# Altium schematic sheet Sheet2.SchDoc
size B
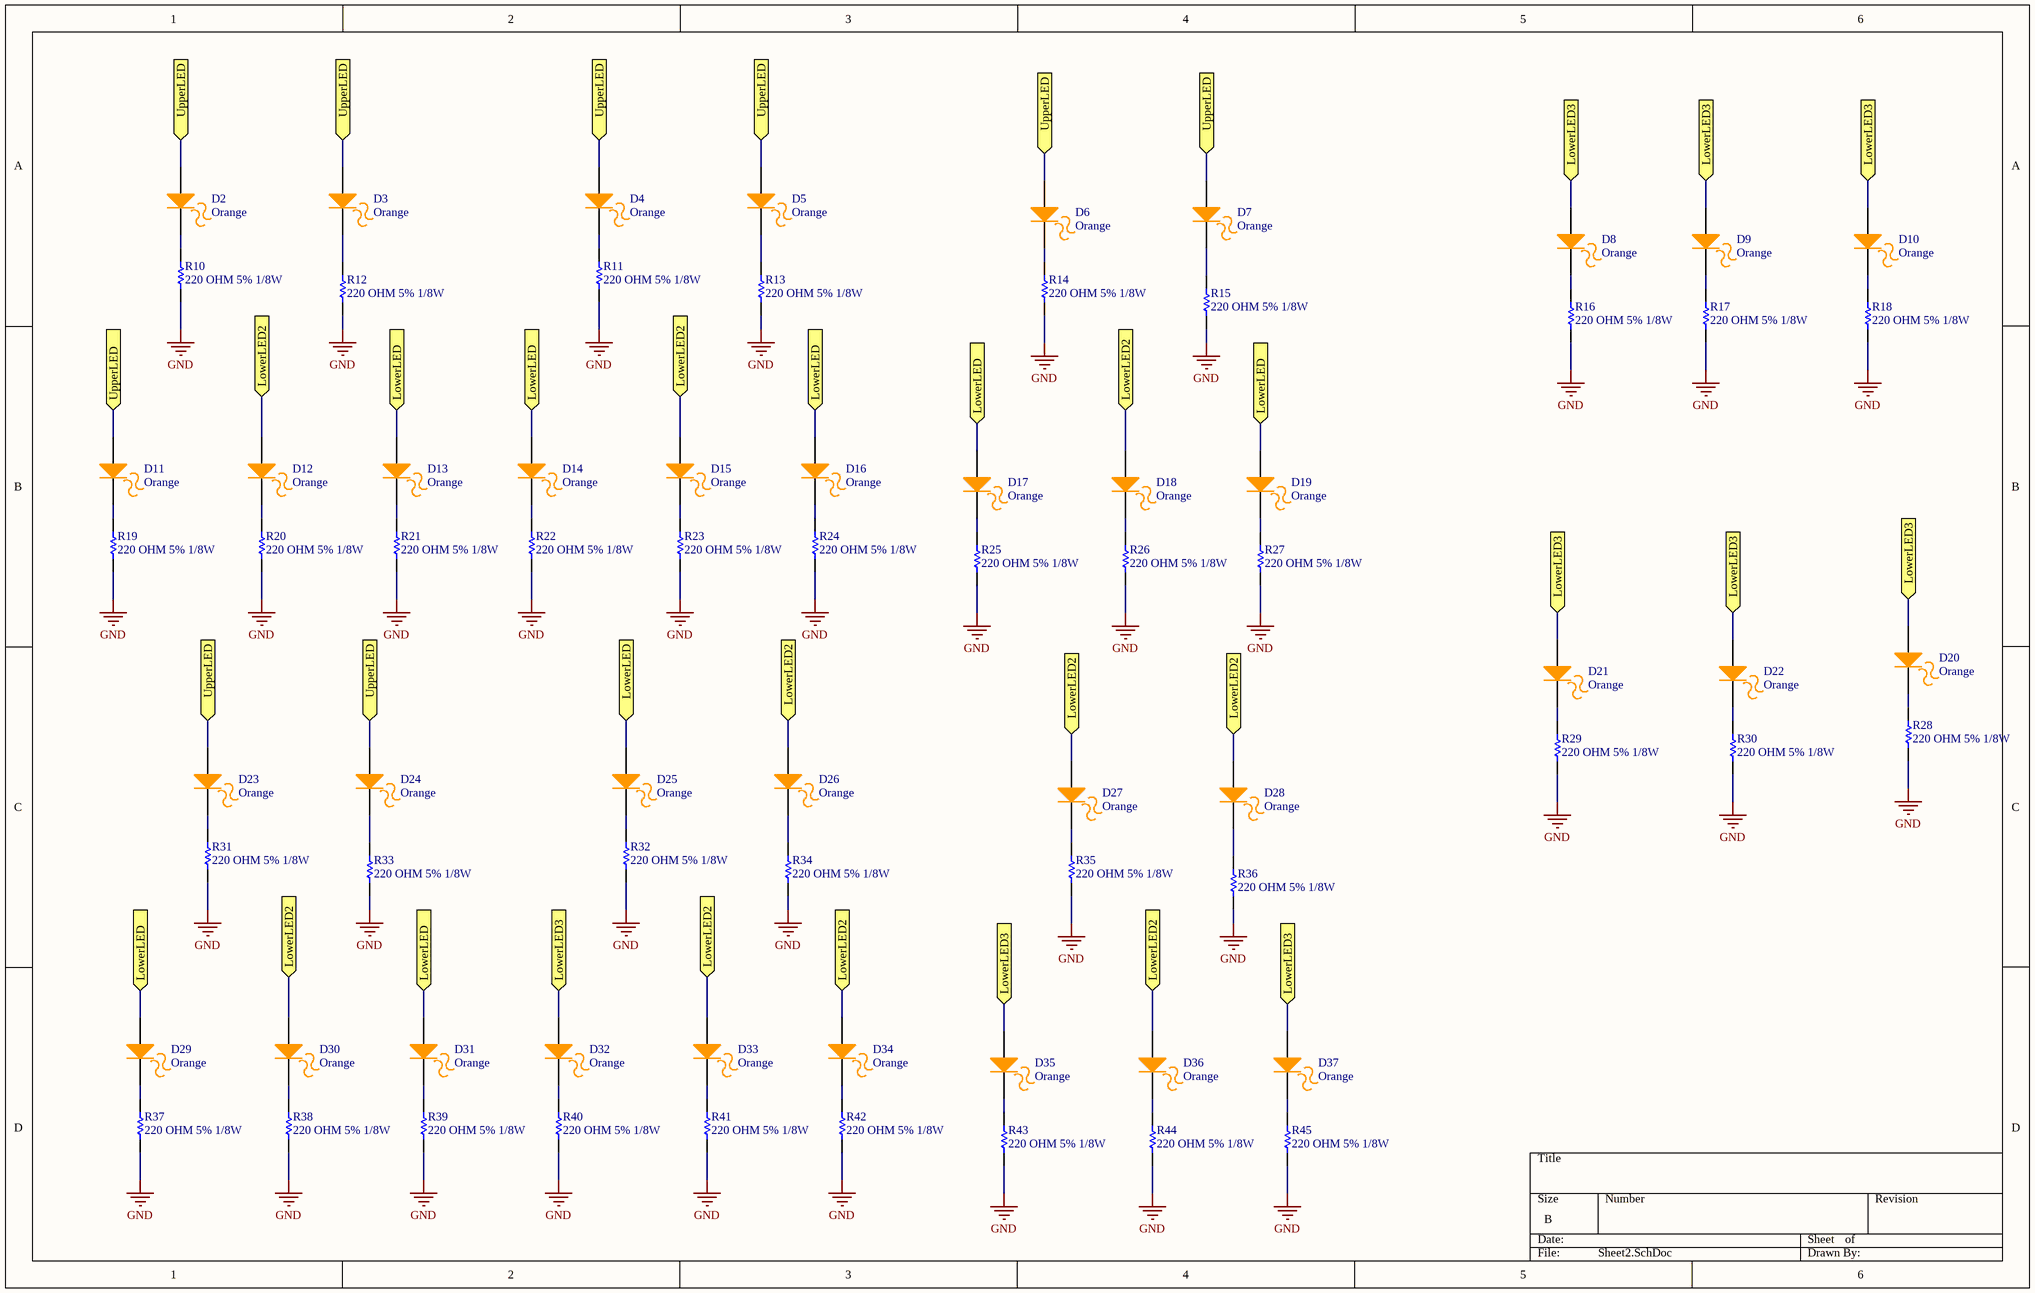
[diagram p0: Sheet2.SchDoc]

## Parts
D2  Orange  [0603 LED Green]
D3  Orange  [0603 LED Green]
D4  Orange  [0603 LED Green]
D5  Orange  [0603 LED Green]
D6  Orange  [0603 LED Green]
D7  Orange  [0603 LED Green]
D8  Orange  [0603 LED Green]
D9  Orange  [0603 LED Green]
D10  Orange  [0603 LED Green]
D11  Orange  [0603 LED Green]
D12  Orange  [0603 LED Green]
D13  Orange  [0603 LED Green]
D14  Orange  [0603 LED Green]
D15  Orange  [0603 LED Green]
D16  Orange  [0603 LED Green]
D17  Orange  [0603 LED Green]
D18  Orange  [0603 LED Green]
D19  Orange  [0603 LED Green]
D20  Orange  [0603 LED Green]
D21  Orange  [0603 LED Green]
D22  Orange  [0603 LED Green]
D23  Orange  [0603 LED Green]
D24  Orange  [0603 LED Green]
D25  Orange  [0603 LED Green]
D26  Orange  [0603 LED Green]
D27  Orange  [0603 LED Green]
D28  Orange  [0603 LED Green]
D29  Orange  [0603 LED Green]
D30  Orange  [0603 LED Green]
D31  Orange  [0603 LED Green]
D32  Orange  [0603 LED Green]
D33  Orange  [0603 LED Green]
D34  Orange  [0603 LED Green]
D35  Orange  [0603 LED Green]
D36  Orange  [0603 LED Green]
D37  Orange  [0603 LED Green]
R10  220 OHM 5% 1/8W  [SMD-0805-RES]
R11  220 OHM 5% 1/8W  [SMD-0805-RES]
R12  220 OHM 5% 1/8W  [SMD-0805-RES]
R13  220 OHM 5% 1/8W  [SMD-0805-RES]
R14  220 OHM 5% 1/8W  [SMD-0805-RES]
R15  220 OHM 5% 1/8W  [SMD-0805-RES]
R16  220 OHM 5% 1/8W  [SMD-0805-RES]
R17  220 OHM 5% 1/8W  [SMD-0805-RES]
R18  220 OHM 5% 1/8W  [SMD-0805-RES]
R19  220 OHM 5% 1/8W  [SMD-0805-RES]
R20  220 OHM 5% 1/8W  [SMD-0805-RES]
R21  220 OHM 5% 1/8W  [SMD-0805-RES]
R22  220 OHM 5% 1/8W  [SMD-0805-RES]
R23  220 OHM 5% 1/8W  [SMD-0805-RES]
R24  220 OHM 5% 1/8W  [SMD-0805-RES]
R25  220 OHM 5% 1/8W  [SMD-0805-RES]
R26  220 OHM 5% 1/8W  [SMD-0805-RES]
R27  220 OHM 5% 1/8W  [SMD-0805-RES]
R28  220 OHM 5% 1/8W  [SMD-0805-RES]
R29  220 OHM 5% 1/8W  [SMD-0805-RES]
R30  220 OHM 5% 1/8W  [SMD-0805-RES]
R31  220 OHM 5% 1/8W  [SMD-0805-RES]
R32  220 OHM 5% 1/8W  [SMD-0805-RES]
R33  220 OHM 5% 1/8W  [SMD-0805-RES]
R34  220 OHM 5% 1/8W  [SMD-0805-RES]
R35  220 OHM 5% 1/8W  [SMD-0805-RES]
R36  220 OHM 5% 1/8W  [SMD-0805-RES]
R37  220 OHM 5% 1/8W  [SMD-0805-RES]
R38  220 OHM 5% 1/8W  [SMD-0805-RES]
R39  220 OHM 5% 1/8W  [SMD-0805-RES]
R40  220 OHM 5% 1/8W  [SMD-0805-RES]
R41  220 OHM 5% 1/8W  [SMD-0805-RES]
R42  220 OHM 5% 1/8W  [SMD-0805-RES]
R43  220 OHM 5% 1/8W  [SMD-0805-RES]
R44  220 OHM 5% 1/8W  [SMD-0805-RES]
R45  220 OHM 5% 1/8W  [SMD-0805-RES]

## Ports
LowerLED, LowerLED2, LowerLED3, UpperLED

## Nets
GND: R10.1 R11.1 R12.1 R13.1 R14.1 R15.1 R16.1 R17.1 R18.1 R19.1 R20.1 R21.1 R22.1 R23.1 R24.1 R25.1 R26.1 R27.1 R28.1 R29.1 R30.1 R31.1 R32.1 R33.1 R34.1 R35.1 R36.1 R37.1 R38.1 R39.1 R40.1 R41.1 R42.1 R43.1 R44.1 R45.1
LowerLED: D13.1(Anode) D14.1(Anode) D16.1(Anode) D17.1(Anode) D19.1(Anode) D25.1(Anode) D29.1(Anode) D31.1(Anode) ; port LowerLED
LowerLED2: D12.1(Anode) D15.1(Anode) D18.1(Anode) D26.1(Anode) D27.1(Anode) D28.1(Anode) D30.1(Anode) D33.1(Anode) D34.1(Anode) D36.1(Anode) ; port LowerLED2
LowerLED3: D8.1(Anode) D9.1(Anode) D10.1(Anode) D20.1(Anode) D21.1(Anode) D22.1(Anode) D32.1(Anode) D35.1(Anode) D37.1(Anode) ; port LowerLED3
UpperLED: D2.1(Anode) D3.1(Anode) D4.1(Anode) D5.1(Anode) D6.1(Anode) D7.1(Anode) D11.1(Anode) D23.1(Anode) D24.1(Anode) ; port UpperLED
NetD2_2: D2.2(Cathode) R10.2
NetD3_2: D3.2(Cathode) R12.2
NetD4_2: D4.2(Cathode) R11.2
NetD5_2: D5.2(Cathode) R13.2
NetD6_2: D6.2(Cathode) R14.2
NetD7_2: D7.2(Cathode) R15.2
NetD8_2: D8.2(Cathode) R16.2
NetD9_2: D9.2(Cathode) R17.2
NetD10_2: D10.2(Cathode) R18.2
NetD11_2: D11.2(Cathode) R19.2
NetD12_2: D12.2(Cathode) R20.2
NetD13_2: D13.2(Cathode) R21.2
NetD14_2: D14.2(Cathode) R22.2
NetD15_2: D15.2(Cathode) R23.2
NetD16_2: D16.2(Cathode) R24.2
NetD17_2: D17.2(Cathode) R25.2
NetD18_2: D18.2(Cathode) R26.2
NetD19_2: D19.2(Cathode) R27.2
NetD20_2: D20.2(Cathode) R28.2
NetD21_2: D21.2(Cathode) R29.2
NetD22_2: D22.2(Cathode) R30.2
NetD23_2: D23.2(Cathode) R31.2
NetD24_2: D24.2(Cathode) R33.2
NetD25_2: D25.2(Cathode) R32.2
NetD26_2: D26.2(Cathode) R34.2
NetD27_2: D27.2(Cathode) R35.2
NetD28_2: D28.2(Cathode) R36.2
NetD29_2: D29.2(Cathode) R37.2
NetD30_2: D30.2(Cathode) R38.2
NetD31_2: D31.2(Cathode) R39.2
NetD32_2: D32.2(Cathode) R40.2
NetD33_2: D33.2(Cathode) R41.2
NetD34_2: D34.2(Cathode) R42.2
NetD35_2: D35.2(Cathode) R43.2
NetD36_2: D36.2(Cathode) R44.2
NetD37_2: D37.2(Cathode) R45.2

## Library data of the parts
D2-D37 = LTST-C191KFKT: LED ORANGE CLEAR SMD; Manufacturer: Lite-On Inc.; Number: LTST-C191KFKT
R10-R45 = RC0805JR-07220RL: RES SMD 220 OHM 5% 1/8W 0805; Manufacturer: Yageo; Number: RC0805JR-07220RL